# EAGLE design battery_board_connector (EAGLE 9.6.2)
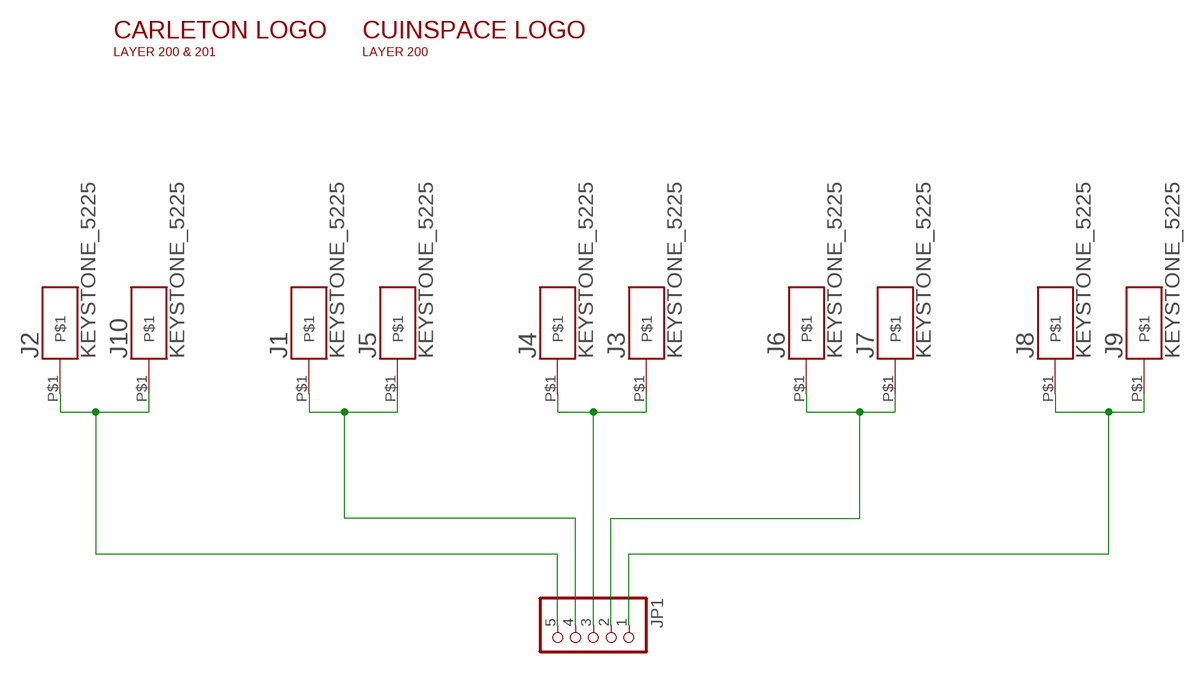
[diagram p0: schematic, sheet 1]

## Parts
J1  KEYSTONE_5225  [KEYSTONE_5225]
J2  KEYSTONE_5225  [KEYSTONE_5225]
J3  KEYSTONE_5225  [KEYSTONE_5225]
J4  KEYSTONE_5225  [KEYSTONE_5225]
J5  KEYSTONE_5225  [KEYSTONE_5225]
J6  KEYSTONE_5225  [KEYSTONE_5225]
J7  KEYSTONE_5225  [KEYSTONE_5225]
J8  KEYSTONE_5225  [KEYSTONE_5225]
J9  KEYSTONE_5225  [KEYSTONE_5225]
J10  KEYSTONE_5225  [KEYSTONE_5225]
JP1  PINHD-1X5  [1X05]
U$1  INSPACE3CM  [INSPACE_3CM]
U$2  CARLETON3CM  [CARLETONU_3CM]

## Nets
N$1: J2.P$1 J10.P$1 JP1.5
N$2: J1.P$1 J5.P$1 JP1.4
N$3: J3.P$1 J4.P$1 JP1.3
N$4: J6.P$1 J7.P$1 JP1.2
N$5: J8.P$1 J9.P$1 JP1.1

## Library data of the parts
J1-J10 = Battery_Contacts:KEYSTONE_5225
JP1 = pinhead:PINHD-1X5: PIN HEADER
U$1 = Logos:INSPACE
U$2 = Logos:CARLETON

## Board
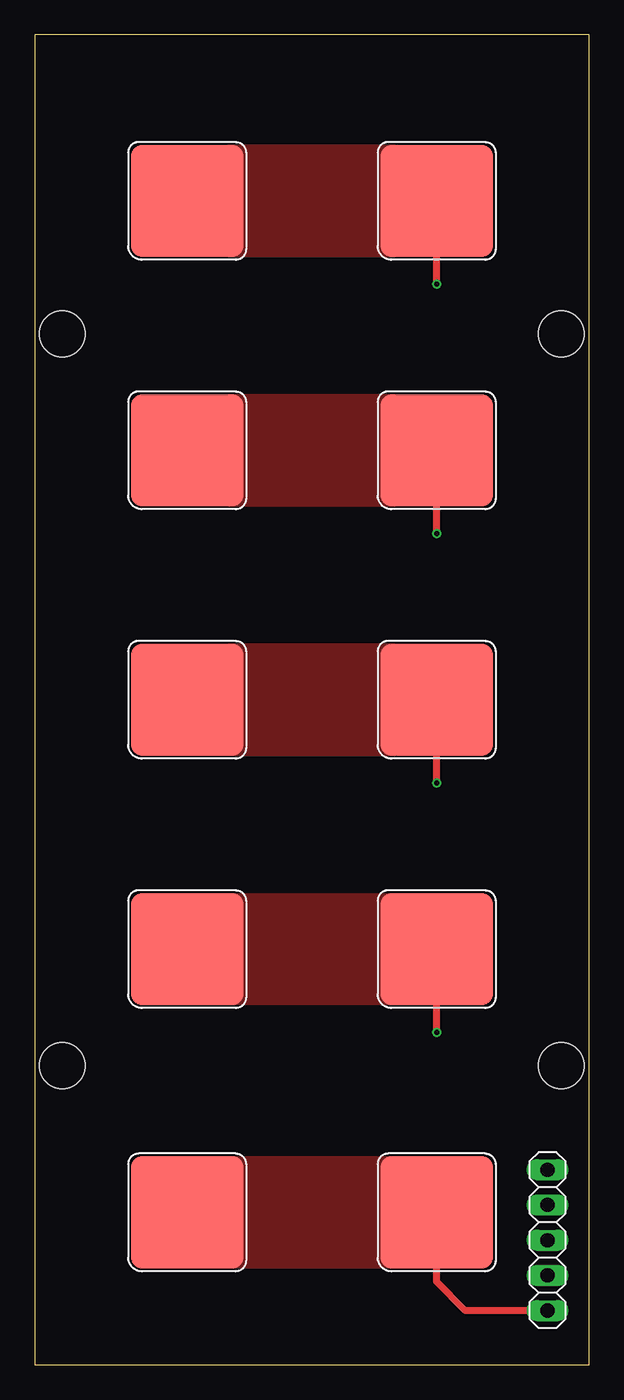
[diagram p1: board, top side]
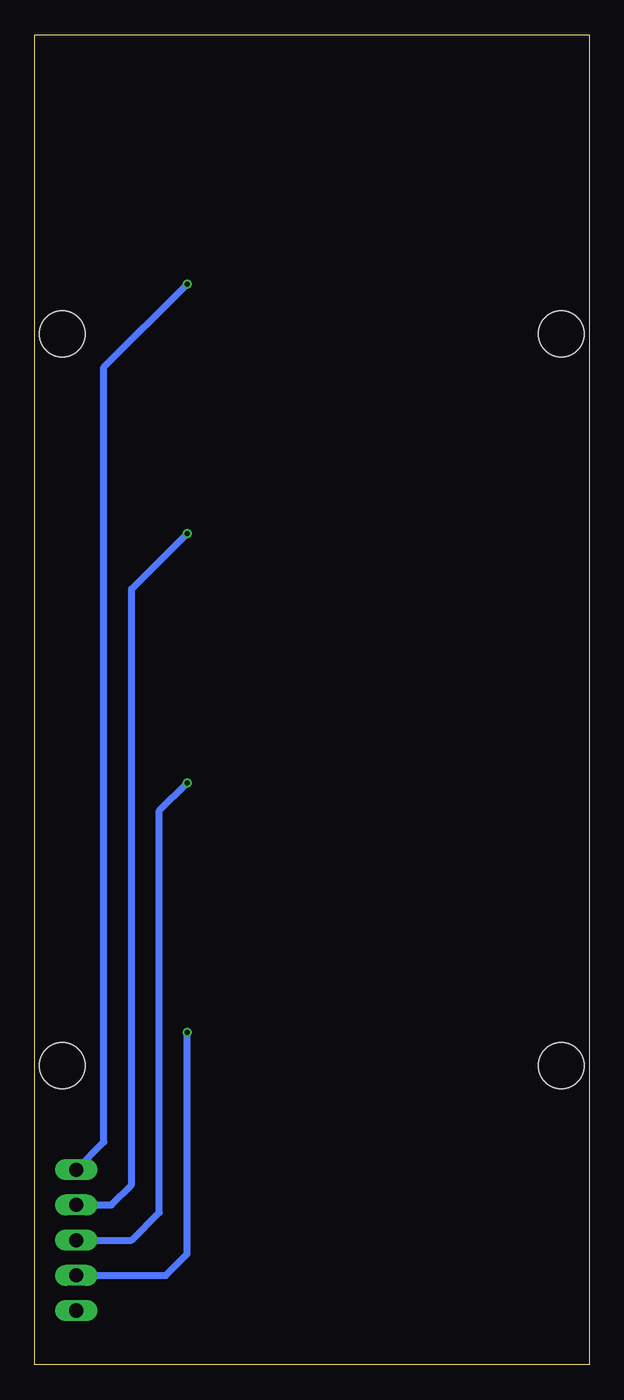
[diagram p2: board, bottom side, seen from below]

Size 40 x 96 mm. Coordinates in mm from the lower left corner, seen from the top.
Outline: 0,0 40,0 40,96 0,96 0,0
Copper layers (1*16): Top 0.035mm / dielectric 1.5mm / Bottom 0.035mm
Design rules "JLCPCB": minimum track width 3.5mil, minimum drill 0.2mm, track to track 5mil, track to pad 5mil, pad to pad 5mil, via to via 5mil, smd to smd 0mil, copper to edge 10mil, drill to drill 10mil, minimum pad ring 3mil, minimum via ring 6mil, stop-mask expansion 2mil, vias tented up to drill 25mil, thermal gap 10mil
Holes 3.3 mm at 38,74.4 2,74.4 38,21.6 2,21.6

### Footprints (pad centres in the part's own frame; a part is rotated, then mirrored left to right if it is on the bottom)
KEYSTONE_5225 = smd 8.1 x 8.1: P$1 0,0
1X05 = drill 1.016 long: 1 -5.08,0; 2 -2.54,0; 3 0,0; 4 2.54,0; 5 5.08,0

### Placement (x,y rotation side)
J1  11,30 0 top
J2  11,11 0 top
J3  29,48 0 top
J4  11,48 0 top
J5  29,30 0 top
J6  11,66 0 top
J7  29,66 0 top
J8  11,84 0 top
J9  29,84 0 top
J10  29,11 0 top
JP1  37,9 270 top
U$1  36,59 0 bottom
U$2  36,26 0 bottom

### Tracks (layer width: path | path; a pad name or v marks a point on that pad's centre or on a via)
N$1
  Top 0.5: JP1.5 31.08,3.92 29,6 J10.P$1
  pour Top: 14,15 14,7 26,7 26,15
N$2  (via drill 0.35)
  Top 0.5: v29,24 J5.P$1
  Bottom 0.5: JP1.4 30.54,6.46 29,8 v29,24
  pour Top: 14,34 14,26 26,26 26,34
N$3  (via drill 0.35)
  Top 0.5: v29,42 J3.P$1
  Bottom 0.5: JP1.3 33,9 31,11 31,40 v29,42
  pour Top: 14,52 14,44 26,44 26,52
N$4  (via drill 0.35)
  Top 0.5: v29,60 J7.P$1
  Bottom 0.5: JP1.2 34.46,11.54 33,13 33,56 v29,60
  pour Top: 14,70 14,62 26,62 26,70
N$5  (via drill 0.35)
  Top 0.5: v29,78 J9.P$1
  Bottom 0.33: JP1.1 36.92,14.08
  Bottom 0.5: JP1.1 35,16.08 35,72 v29,78
  pour Top: 14,88 14,80 26,80 26,88